# EAGLE schematic Square8 (EAGLE 6.4)
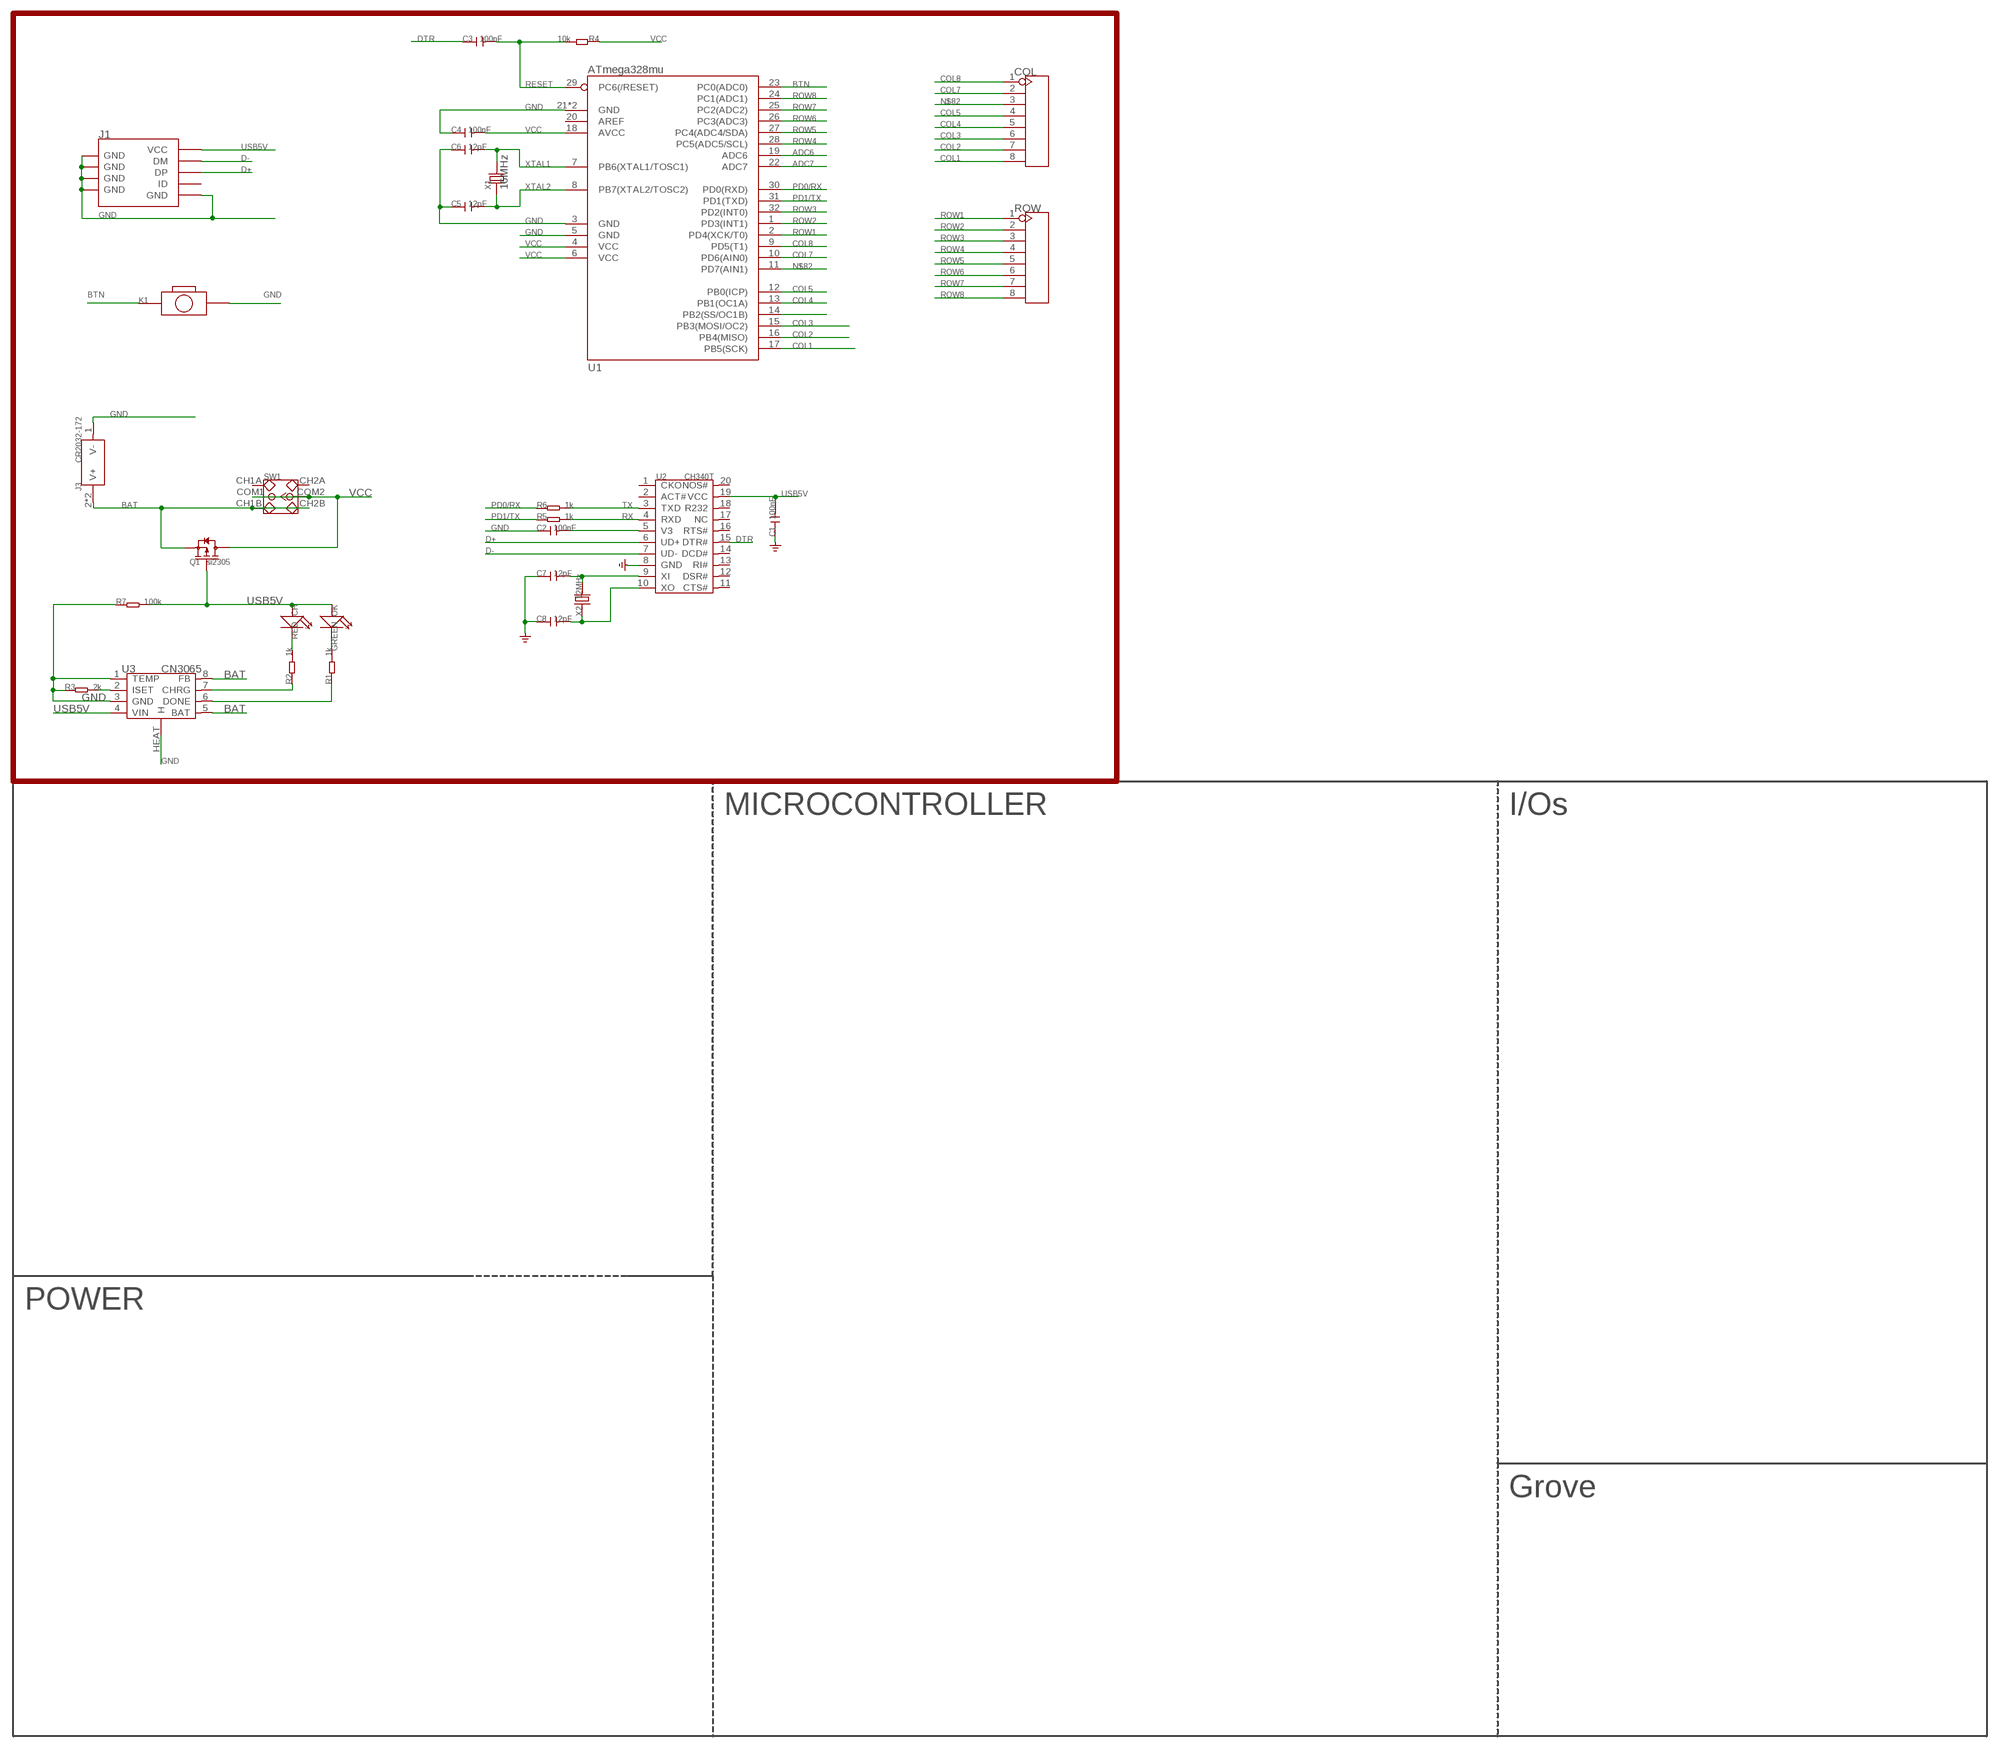
[diagram p0: schematic, sheet 1]

## Parts
C1  100nF  C'2.54'  [CERAMIC-2.54]
C2  100nF  C'2.54'  [CERAMIC-2.54]
C3  100nF  C'2.54'  [CERAMIC-2.54]
C4  100nF  C'2.54'  [CERAMIC-2.54]
C5  12pF  C-0603  [C0603]
C6  12pF  C-0603  [C0603]
C7  12pF  C-0603  [C0603]
C8  12pF  C-0603  [C0603]
CH  RED  LED-3MM  [LED-2P-2.54-3MM]
COL  HEADER-8P-2.54  [8P-2.54]
J1  USB-MINIUSB-5P-MICRO  [MICRO-USB]
J3  CR2032-172  HOLDER-BAT-CIRCLE  [2032-D20-CIRCLE]
K1  BUTTON-2P'TS-1101F'  [2P-3.4X6.0X3.55H-90D]
OK  GREEN  LED-3MM  [LED-2P-2.54-3MM]
Q1  si2305  MOSFET-P'SI2323CDS/SI2305DS<BR>'  [SOT23]
R1  1k  R-0204/7  [R0204/7]
R2  1k  R-0204/7  [R0204/7]
R3  2k  R-0204/7  [R0204/7]
R4  10k  R-0204/7  [R0204/7]
R5  1k  R-0204/7  [R0204/7]
R6  1k  R-0204/7  [R0204/7]
R7  100k  R-0603  [R0603]
ROW  HEADER-8P-2.54  [8P-2.54]
SW1  SWITCH-2CH-6P'90D'  [6P-2CH-2.5-9.1X3.5X3.2H-90D]
U1  ATmega328mu  ATMEGA8/168/328MLF  [MLF32X-W/HEAT]
U2  CH340T  [SSOP20]
U3  CN3065  [DFN8]
X1  16MHz  CRYSTAL'HC49S'  [HC49S]
X2  12MHz  CRYSTAL'HC49S'  [HC49S]

## Nets
ADC6: U1.19(ADC6)
ADC7: U1.22(ADC7)
BAT: J3.2(V+) J3.3(V+) Q1.2(S) SW1.CH1B SW1.CH2B U3.5(BAT) U3.8(FB)
BTN: K1.P$1 U1.23(PC0(ADC0))
COL1: COL.8 U1.17(PB5(SCK))
COL2: COL.7 U1.16(PB4(MISO))
COL3: COL.6 U1.15(PB3(MOSI/OC2))
COL4: COL.5 U1.13(PB1(OC1A))
COL5: COL.4 U1.12(PB0(ICP))
COL7: COL.2 U1.10(PD6(AIN0))
COL8: COL.1 U1.9(PD5(T1))
D+: J1.3(DP) U2.6(UD+)
D-: J1.2(DM) U2.7(UD-)
DTR: C3.1 U2.15(DTR#)
GND [none1]: C1.1 C2.1 C4.1 C5.1 C6.1 C7.1 C8.1 J1.5(GND) J1.S1(GND) J1.S2(GND) J1.S3(GND) J1.S4(GND) J1.S5(GND) J1.S6(GND) J3.1(V-) K1.P$2 R3.1 R7.1 U1.3(GND) U1.5(GND) U1.21(GND) U1.HEAT(GND) U2.8(GND) U3.1(TEMP) U3.3(GND) U3.HEAT(H)
N$1: U1.14(PB2(SS/OC1B))
N$2: R2.1 U3.7(CHRG)
N$3: R1.1 U3.6(DONE)
N$4: OK.K(-) R1.2
N$5: CH.K(-) R2.2
N$7: R3.2 U3.2(ISET)
N$39: C7.2 U2.9(XI) X2.2
N$40: C8.2 U2.10(XO) X2.1
N$82: COL.3 U1.11(PD7(AIN1))
PD0/RX: R6.1 U1.30(PD0(RXD))
PD1/TX: R5.1 U1.31(PD1(TXD))
RESET: C3.2 R4.2 U1.29(PC6(/RESET))
ROW1: ROW.1 U1.2(PD4(XCK/T0))
ROW2: ROW.2 U1.1(PD3(INT1))
ROW3: ROW.3 U1.32(PD2(INT0))
ROW4: ROW.4 U1.28(PC5(ADC5/SCL))
ROW5: ROW.5 U1.27(PC4(ADC4/SDA))
ROW6: ROW.6 U1.26(PC3(ADC3))
ROW7: ROW.7 U1.25(PC2(ADC2))
ROW8: ROW.8 U1.24(PC1(ADC1))
RX: R5.2 U2.4(RXD)
TX: R6.2 U2.3(TXD)
USB5V: C1.2 CH.A(+) J1.1(VCC) OK.A(+) Q1.1(G) R7.2 U2.19(VCC) U3.4(VIN)
V3: C2.2 U2.5(V3)
VCC: C4.2 Q1.3(D) R4.1 SW1.COM1 SW1.COM2 U1.4(VCC) U1.6(VCC) U1.18(AVCC)
XTAL1: C6.2 U1.7(PB6(XTAL1/TOSC1)) X1.2
XTAL2: C5.2 U1.8(PB7(XTAL2/TOSC2)) X1.1
Unconnected: J1.4(ID) SW1.CH1A SW1.CH2A U1.20(AREF) U2.1(CKO) U2.2(ACT#) U2.11(CTS#) U2.12(DSR#) U2.13(RI#) U2.14(DCD#) U2.16(RTS#) U2.17(NC) U2.18(R232) U2.20(NOS#)

## Notes on the sheet
- MICROCONTROLLER | I/Os
- POWER
- Grove

## Library data of the parts
C1-C8 = Discrete:C*: Ceramic Capacitors
CH OK = Discrete:LED*
COL ROW = Connector :HEADER-8P
J1 = dwin:USB-MINIUSB-5P
J3 = dwin:HOLDER-BAT: button cell holder
K1 = Discrete:BUTTON-2P
Q1 = Discrete:MOSFET-P
R1-R7 = Discrete:R*
SW1 = Discrete:SWITCH-2CH-6P
U1 = IC:ATMEGA8/168/328: MICROCONTROLLER
U2 = template:CH340T
U3 = IC:CN3065
X1 X2 = Discrete:CRYSTAL*: CRYSTAL

## Net classes
0 default: width 0.152 mm, drill 0.305 mm, clearance 0.152 mm
3 usbvcc: width 0.203 mm, drill 0.305 mm, clearance 0.203 mm